# Altium schematic sheet top.SchDoc
size A
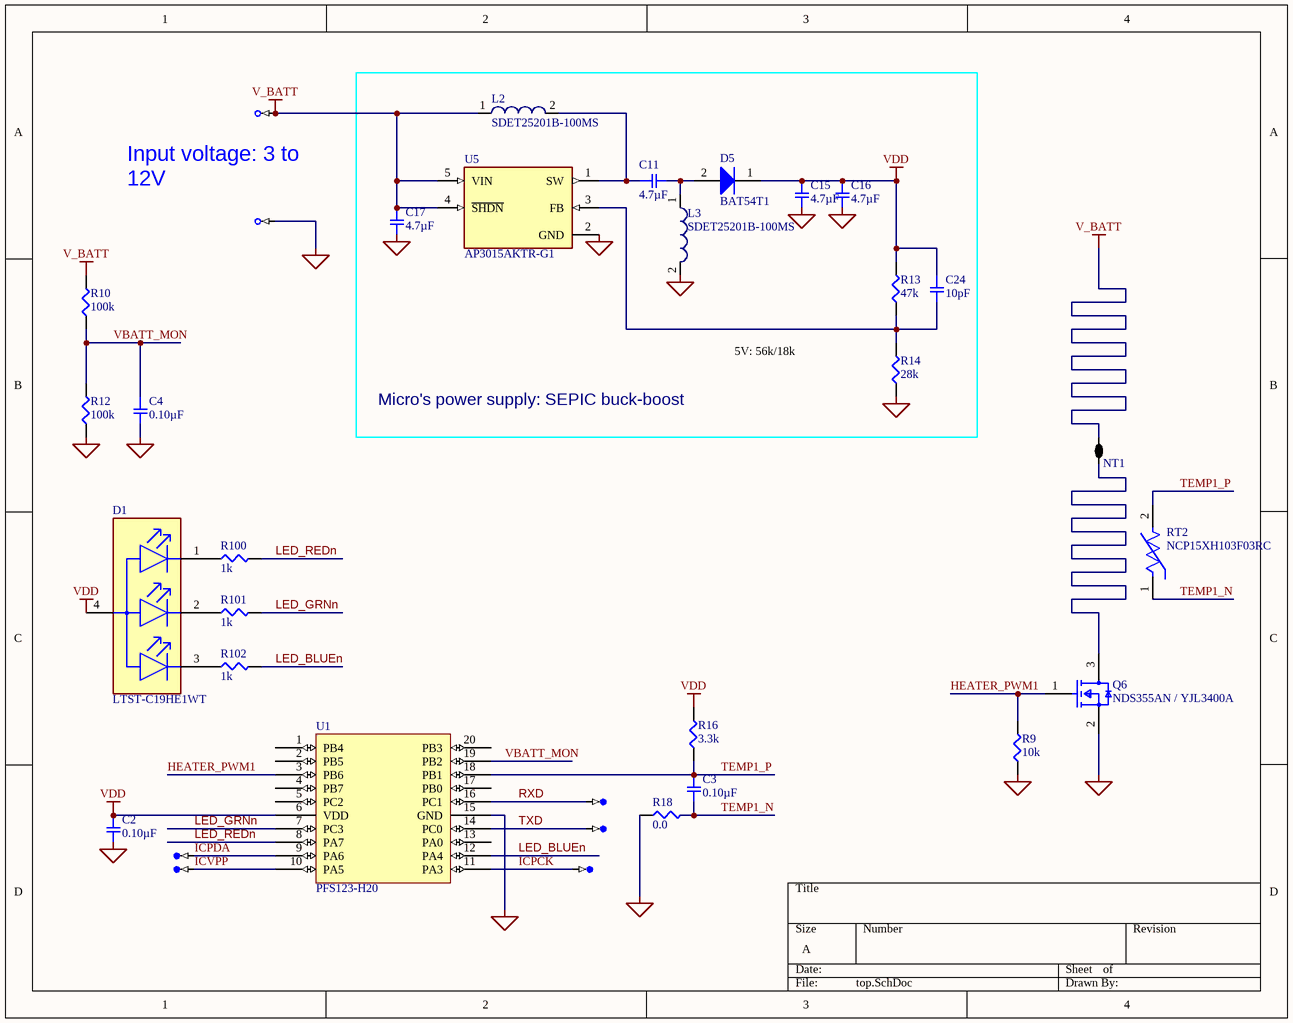
[diagram p0: top.SchDoc]

## Parts
1  TP-TH-C-152-H90  [TP-TH-C-152-H90]  (value not drawn)  (no BOM)
2  TP-TH-C-152-H90  [TP-TH-C-152-H90]  (value not drawn)  (no BOM)
C2  0.10µF  [SMD-0402C]
C3  0.10µF  [SMD-0402C]
C4  0.10µF  [SMD-0402C]
C11  4.7µF  [SMD-0603C]
C15  4.7µF  [SMD-0603C]
C16  4.7µF  [SMD-0603C]
C17  4.7µF  [SMD-0603C]
C24  10pF  [SMD-0402C]
D1  LTST-C19HE1WT  [FP-LTST-C19HE1WT-MFG]
D5  BAT54T1  [ONSC-SOD-123-2-425-04_V]
L2  SDET25201B-100MS  [WE-LQS 252012]
L3  SDET25201B-100MS  [WE-LQS 252012]
NT1  2 way net tie junction  [2way_LP]  (value not drawn)  (net tie, no BOM)
Q6  NDS355AN / YJL3400A  [FP-527AG-01-IPC_C]
R9  10k  [SMD-0402-RES]
R10  100k  [SMD-0402-RES]
R12  100k  [SMD-0402-RES]
R13  47k  [SMD-0402-RES]
R14  28k  [SMD-0402-RES]
R16  3.3k  [SMD-0402-RES]
R18  0.0  [SMD-0402-RES]
R100  1k  [SMD-0402-RES]
R101  1k  [SMD-0402-RES]
R102  1k  [SMD-0402-RES]
RT2  NCP15XH103F03RC  [FP-NCP15-NCU15-0_05-IPC_C]
TP1  TP-SM-C-100  [TP-SM-C-100]  (value not drawn)  (no BOM)
TP2  TP-SM-C-100  [TP-SM-C-100]  (value not drawn)  (no BOM)
TP3  TP-SM-C-100  [TP-SM-C-100]  (value not drawn)  (no BOM)
TP4  TP-SM-C-100  [TP-SM-C-100]  (value not drawn)  (no BOM)
TP5  TP-SM-C-100  [TP-SM-C-100]  (value not drawn)  (no BOM)
U1  PFS123-H20  [TSOP100P600X135-20N]
U5  AP3015AKTR-G1  [SOT95P280X145-5N]

## Blocks framed on the sheet
Micro's power supply: SEPIC buck-boost: C11 C15-C17 C24 D5 L2 L3 R13 R14 U5

## Nets
GND: 2.1 C2.2 C4.2 C15.2 C16.2 C17.2 L3.2 Q6.2(S) R9.1 R12.1 R14.1 R18.1 U1.15(GND) U5.2(GND)
V_BATT: 1.1 C17.1 L2.1 NT1.1 R10.2 U5.4(~{SHDN}) U5.5(VIN)
VDD: C2.1 C15.1 C16.1 C24.1 D1.4(A) D5.1(K) R13.2 R16.2 U1.6(VDD)
HEATER_PWM1: Q6.1(G) R9.2 U1.3(PB6)
ICPCK: TP3.1 U1.11(PA3)
ICPDA: TP1.1 U1.9(PA6)
ICVPP: TP2.1 U1.10(PA5)
LED_BLUEn: R102.2 U1.12(PA4)
LED_GRNn: R101.2 U1.7(PC3)
LED_REDn: R100.2 U1.8(PA7)
RXD: TP4.1 U1.16(PC1)
TEMP1_N: C3.2 R18.2 RT2.1
TEMP1_P: C3.1 R16.1 RT2.2 U1.18(PB1)
TXD: TP5.1 U1.14(PC0)
VBATT_MON: C4.1 R10.1 R12.2 U1.19(PB2)
NetC11_1: C11.1 L2.2 U5.1(SW)
NetC11_2: C11.2 D5.2(A) L3.1
NetC24_2: C24.2 R13.1 R14.2 U5.3(FB)
NetD1_1: D1.1(RED_C) R100.1
NetD1_2: D1.2(GREEN_C) R101.1
NetD1_3: D1.3(BLUE_C) R102.1
NetNT1_2: NT1.2 Q6.3(D)

Not connected (* = marked no-connect by the designer): U1 1(PB4) 2(PB5) 4(PB7) 5(PC2) 13(PA0) 17(PB0) 20(PB3)

## Notes on the sheet
- (near 1) +
- Input voltage: 3 to 12V
- (near 2) -
- 5V: 56k/18k

## Library data of the parts
1 2 = TP-TH-C-152-H90: Test Point, Through Hole, Hole Size 0.9 mm, PCB Mount with Silkscreen Box
C2-C4 = GRM152R61A104KE19D: CAP CER 0.1UF 10V X5R 0402; Manufacturer: Murata Electronics North America; Factory Stock: 0; Unit Price (USD): 0.16; Minimum Quantity: 1; Tolerance: ±10%; Datasheets: http://www.murata.com/~/media/webrenewal/support/library/catalog/products/capacitor/mlcc/c02e.pdf; Image: //media.digikey.com/Renders/Murata%20Renders/ZRB-SERIES-0402.jpg; Digi-Key Part Number: 490-10008-1-ND; Part Number: GRM152R61A104KE19D; Quantity Available: 80241; @ qty: 0; Packaging: Cut Tape (CT); Series: GRM; Part Status: Active; Value: 0.10µF; Voltage: 10V; Temperature Coefficient: X5R; Operating Temperature: -55°C ~ 85°C; Features: Derating Recommended; Ratings: -; Applications: General Purpose; Mounting Type: Surface Mount, MLCC; Package / Case: 0402 (1005 Metric); Size / Dimension: 0.039" L x 0.020" W (1.00mm x 0.50mm); Height - Seated (Max): -; Thickness (Max): 0.009" (0.22mm); Lead Spacing: -; Lead Style: -
C11 C15-C17 = GRM185C81A475KE11D: CAP CER 4.7UF 10V X6S 0603; Manufacturer: Murata Electronics North America; Factory Stock: 0; Unit Price (USD): 0.51; Minimum Quantity: 1; Tolerance: ±10%; Datasheets: http://www.murata.com/~/media/webrenewal/support/library/catalog/products/capacitor/mlcc/c02e.pdf; Image: //media.digikey.com/Renders/Murata%20Renders/ZRB-SERIES-0402.jpg; Digi-Key Part Number: 490-10464-1-ND; Part Number: GRM185C81A475KE11D; Quantity Available: 1360; @ qty: 0; Packaging: Cut Tape (CT); Series: GRM; Part Status: Active; Value: 4.7µF; Voltage: 10V; Temperature Coefficient: X6S; Operating Temperature: -55°C ~ 105°C; Features: Derating Recommended; Ratings: -; Applications: General Purpose; Mounting Type: Surface Mount, MLCC; Package / Case: 0603 (1608 Metric); Size / Dimension: 0.063" L x 0.031" W (1.60mm x 0.80mm); Height - Seated (Max): -; Thickness (Max): 0.022" (0.55mm); Lead Spacing: -; Lead Style: -
C24 = GCM1555C1H100JA16D: CAP CER 10PF 50V NP0 0402; Manufacturer: Murata Electronics North America; Factory Stock: 0; Unit Price (USD): 0.1; Minimum Quantity: 1; Tolerance: ±5%; Temperature Coefficient: C0G, NP0; Datasheets: http://www.murata.com/~/media/webrenewal/support/library/catalog/products/capacitor/mlcc/c03e.ashx; Image: //media.digikey.com/Renders/Murata%20Renders/ZRB-SERIES-0402.jpg; Digi-Key Part Number: 490-10668-1-ND; Part Number: GCM1555C1H100JA16D; Quantity Available: 966; @ qty: 0; Packaging: Cut Tape (CT); Series: GCM; Part Status: Active; Value: 10pF; Voltage: 50V; Operating Temperature: -55°C ~ 125°C; Features: -; Ratings: AEC-Q200; Applications: Automotive; Mounting Type: Surface Mount, MLCC; Package / Case: 0402 (1005 Metric); Size / Dimension: 0.039" L x 0.020" W (1.00mm x 0.50mm); Height - Seated (Max): -; Thickness (Max): 0.022" (0.55mm); Lead Spacing: -; Lead Style: -
D1 = CMP-2000-05201-2: LED RGB DIFFUSED CHIP SMD; Number of LEDs: 3; Test Current: 20mA; Luminous Intensity: 180mcd; Lens Color: White; Dominant Wavelength: 470nm; Color: Blue; Reverse Voltage: 5V; Viewing Angle: 130°; Forward Voltage: 3.35V; Max Operating Temperature: 80°C; Packaging: Tape and Reel; Lens Transparency: Diffused; Width: 1.6mm; Case Code (Metric): 1616; Height: 0.35mm; Lens Style: Diffused; Mount: Surface Mount; Package Quantity: 3000; Radiation Hardening: No; Length: 1.6mm; Case/Package: 0606; Forward Current: 20mA; Case Code (Imperial): 0606; Lead Free: Lead Free; Min Operating Temperature: -20°C; Number of Elements: 3; Number of Pins: 4; Depth: 1.6mm
D5 = CMP-1055-00428-1: Schottky Barrier Diode, 2-Pin SOD-123, Tape and Reel; Manufacturer: On Semiconductor; Configuration: Single; IFSM Max (A): 0.6; trr Max (ns): 5; ComponentLink1URL: http://www.onsemi.com/; DatasheetVersion: Rev. 9; PartNumber: BAT54T1; ComponentLink2URL: http://www.onsemi.cn/pub_link/Collateral/BAT54T1-D.PDF; Packing: Tape and Reel; ComponentLink3Description: Package Specification; ComponentLink3URL: http://www.onsemi.com/pub_link/Collateral/425-04.PDF; Mounting Technology: Surface Mount; PackageVersion: Rev. G, 10/2009; PackageDescription: 2-Pin SOD, Body 1.6 x 2.69 mm; ComponentLink2Description: Datasheet; RoHS: FALSE; PackageReference: SOD-123-2-425-04; ComponentLink1Description: Manufacturer URL
L2 L3 = CMP-1354-00007-1: FIXED IND 10UH 900MA 408MOHM SMD; Manufacturer: Wuerth Elektronik; PartNumber: 74404024100; Inductance: 10.0 ÂµH; ComponentLink2Description: Datasheet; ComponentLink1URL: http://www.we-online.com; PackageReference: WE-LQS 252012; ComponentLink1Description: Manufacturer URL; ComponentLink2URL: http://katalog.we-online.de/pbs/datasheet/74404024100.pdf
NT1 = 2way: ComponentLink1URL: http://www.edatools.cz/addons; ComponentLink1Description: Source; FootprintNote: LP=12mil, MP=40mil, HP=120mil
Q6 = CMP-2000-06834-2: MOSFET N-CH 30V 1.7A SSOT3; Manufacturer: ON Semiconductor; Gate To Source Voltage: 20V; Threshold Vgs Min: 1V; Pulse Drain Current: 10A; Number Of N Channels: 1; Typ Forward Diode Voltage: 0.8V; Input Capacitace At Vds: 195pF @ 15V; Turn Off Delay Time: 13ns; Gate Charge At Vgs: 3.5nC @ 5V; Rthja Max: 250°C/W; Standoff Height: 0.013mm; Max Forward Diode Voltage: 1.2V; Power Dissipation: 0.46W; Depletion Mode: False; Threshold Vgs Max: 2V; Drain To Source Resistance: 0.105Ω; Turn On Delay Time: 10ns; Max Junction Temp: +150°C; Transconductance: 3.5S; Automotive: No; Drain To Source Voltage: 30V; Temperature: -55°C to +150°C; Device Class L1: Discrete Semiconductors; Number Of Channels: 1; Octopart: https://octopart.com/nds355an-on+semiconductor-84330922; Temperature Range High: +150°C; Category: Trans; Manufacturer Part Number: NDS355AN; Device Class L2: Transistors; RoHS: TRUE; Digikey Description: MOSFET N-CH 30V 1.7A SSOT3; Drain To Source Breakdown Voltage: 30V; Height: 1.22mm; Mouser Description: MOSFET SOT-23 N-CH LOGIC; Temperature Range Low: -55°C; ComponentLink2URL: https://www.onsemi.com/pub/Collateral/NDS355AN-D.PDF; ComponentLink2Description: Datasheet; Continuous Drain Current: 1.7A; Package: 527AG-01; Device Class L3: MOSFETs; Lead Free: Yes; Footprint Url: https://www.onsemi.com/pub/Collateral/527AG.PDF
R9 R13 R14 = ERJ-2GEJ103X: RES SMD 10K OHM 5% 1/10W 0402; Manufacturer: Panasonic Electronic Components; Factory Stock: 0; Unit Price (USD): 0.00350; @ qty: 1500; Minimum Quantity: 1; Power (Watts): 0.1W, 1/10W; Temperature Coefficient: ±200ppm/°C; Part Number: ERJ-2GEJ103X; Datasheets: http://industrial.panasonic.com/www-cgi/jvcr13pz.cgi?E+PZ+3+AOA0001+ERJ2GEJ103X+7+WW; Image: //media.digikey.com/Photos/Panasonic%20Photos/ERJ-PA2-Series.jpg; Digi-Key Part Number: P10KJCT-ND; Quantity Available: 2560215; Packaging: Cut Tape (CT); Series: ERJ; Part Status: Active; Value: 10k; Tolerance: ±5%; Composition: Thick Film; Features: Automotive AEC-Q200; Operating Temperature: -55°C ~ 155°C; Package / Case: 0402 (1005 Metric); Supplier Device Package: 0402; Size / Dimension: 0.039" L x 0.020" W (1.00mm x 0.50mm); Height - Seated (Max): 0.016" (0.40mm); Number of Terminations: 2; Failure Rate: -
R10 R12 = ERJ-2GEJ104X: RES SMD 100K OHM 5% 1/10W 0402; Manufacturer: Panasonic Electronic Components; Factory Stock: 0; Unit Price (USD): 0.00350; @ qty: 1500; Minimum Quantity: 1; Power (Watts): 0.1W, 1/10W; Temperature Coefficient: ±200ppm/°C; Part Number: ERJ-2GEJ104X; Datasheets: http://industrial.panasonic.com/www-cgi/jvcr13pz.cgi?E+PZ+3+AOA0001+ERJ2GEJ104X+7+WW; Image: //media.digikey.com/Photos/Panasonic%20Photos/ERJ-PA2-Series.jpg; Digi-Key Part Number: P100KJCT-ND; Quantity Available: 2387986; Packaging: Cut Tape (CT); Series: ERJ; Part Status: Active; Value: 100k; Tolerance: ±5%; Composition: Thick Film; Features: Automotive AEC-Q200; Operating Temperature: -55°C ~ 155°C; Package / Case: 0402 (1005 Metric); Supplier Device Package: 0402; Size / Dimension: 0.039" L x 0.020" W (1.00mm x 0.50mm); Height - Seated (Max): 0.016" (0.40mm); Number of Terminations: 2; Failure Rate: -
R16 = ERJ-2GEJ332X: RES SMD 3.3K OHM 5% 1/10W 0402; Manufacturer: Panasonic Electronic Components; Factory Stock: 0; Unit Price (USD): 0.00350; @ qty: 1500; Minimum Quantity: 1; Power (Watts): 0.1W, 1/10W; Temperature Coefficient: ±200ppm/°C; Part Number: ERJ-2GEJ332X; Datasheets: http://industrial.panasonic.com/www-cgi/jvcr13pz.cgi?E+PZ+3+AOA0001+ERJ2GEJ332X+7+WW; Image: //media.digikey.com/Photos/Panasonic%20Photos/ERJ-PA2-Series.jpg; Digi-Key Part Number: P3.3KJCT-ND; Quantity Available: 514266; Packaging: Cut Tape (CT); Series: ERJ; Part Status: Active; Value: 3.3k; Tolerance: ±5%; Composition: Thick Film; Features: Automotive AEC-Q200; Operating Temperature: -55°C ~ 155°C; Package / Case: 0402 (1005 Metric); Supplier Device Package: 0402; Size / Dimension: 0.039" L x 0.020" W (1.00mm x 0.50mm); Height - Seated (Max): 0.016" (0.40mm); Number of Terminations: 2; Failure Rate: -
R18 = ERJ-2GE0R00X: RES SMD 0.0OHM JUMPER 1/10W 0402; Manufacturer: Panasonic Electronic Components; Factory Stock: 0; Unit Price (USD): 0.00384; @ qty: 1500; Minimum Quantity: 1; Power (Watts): 0.1W, 1/10W; Part Number: ERJ-2GE0R00X; Datasheets: http://industrial.panasonic.com/www-cgi/jvcr13pz.cgi?E+PZ+3+AOA0001+ERJ2GE0R00X+7+WW; Image: //media.digikey.com/Photos/Panasonic%20Photos/ERJ-PA2-Series.jpg; Digi-Key Part Number: P0.0JCT-ND; Quantity Available: 3152483; Packaging: Cut Tape (CT); Series: ERJ; Part Status: Active; Value: 0.0; Tolerance: Jumper; Composition: Thick Film; Features: Automotive AEC-Q200; Temperature Coefficient: -; Operating Temperature: -55°C ~ 155°C; Package / Case: 0402 (1005 Metric); Supplier Device Package: 0402; Size / Dimension: 0.039" L x 0.020" W (1.00mm x 0.50mm); Height - Seated (Max): 0.016" (0.40mm); Number of Terminations: 2; Failure Rate: -
R100-R102 = ERJ-2GEJ102X: RES SMD 1K OHM 5% 1/10W 0402; Manufacturer: Panasonic Electronic Components; Factory Stock: 0; Unit Price (USD): 0.00350; @ qty: 1500; Minimum Quantity: 1; Power (Watts): 0.1W, 1/10W; Temperature Coefficient: ±200ppm/°C; Part Number: ERJ-2GEJ102X; Datasheets: http://industrial.panasonic.com/www-cgi/jvcr13pz.cgi?E+PZ+3+AOA0001+ERJ2GEJ102X+7+WW; Image: //media.digikey.com/Photos/Panasonic%20Photos/ERJ-PA2-Series.jpg; Digi-Key Part Number: P1.0KJCT-ND; Quantity Available: 1939857; Packaging: Cut Tape (CT); Series: ERJ; Part Status: Active; Value: 1k; Tolerance: ±5%; Composition: Thick Film; Features: Automotive AEC-Q200; Operating Temperature: -55°C ~ 155°C; Package / Case: 0402 (1005 Metric); Supplier Device Package: 0402; Size / Dimension: 0.039" L x 0.020" W (1.00mm x 0.50mm); Height - Seated (Max): 0.016" (0.40mm); Number of Terminations: 2; Failure Rate: -
RT2 = CMP-06022-000003-3: NTC Thermistor for Temperature Sensor, 0402, 10kΩ, 1%, 0.1mA, 5V; Max Power Dissipation: 100mW; Resistance: 10kR; Current Rating: 310uA; Length: 1mm; Min Operating Temperature: -40°C; Max Operating Temperature: 125°C; Resistance Tolerance: 1%; Lead Free: Lead Free; Radiation Hardening: No; Case Code (Imperial): 0402; Depth: 0.5mm; Tolerance: 1%; Packaging: Tape and Reel; Package Quantity: 10000; Series: NCP; Number of Pins: 2; Power Rating: 100mW; Case/Package: 0402; Case Code (Metric): 1005; Height: 0.5mm; Termination: SMD/SMT; RoHS Compliant: Yes; REACH SVHC: No SVHC; Mount: Surface Mount
TP1-TP5 = CMP-0484-00002-2: Test Point, Surface Mount, Circular, Pad Diameter 1 mm; Manufacturer: No Vendor; PartNumber: TP-SM-C-100
U5 = AP3015AKTR-G1: Boost Switching Regulator IC Positive Adjustable 1.23V 1 Output 75mA (Switch) SC-74A, SOT-753; MF: Diodes Inc.; Price: None; Value: *; Package: SOT-23-5 Diodes Inc.; SnapEDA_Link: https://www.snapeda.com/parts/AP3015AKTR-G1/Diodes%20Inc./view-part/490813/?ref=snap; DigiKey-Purchase-URL: https://snapeda.com/shop?store=DigiKey&id=490813; Mouser-Purchase-URL: https://snapeda.com/shop?store=Mouser&id=490813; Availability: Good; MP: AP3015AKTR-G1; Check_prices: https://www.snapeda.com/parts/AP3015AKTR-G1/Diodes%20Inc./view-part/490813/?ref=eda